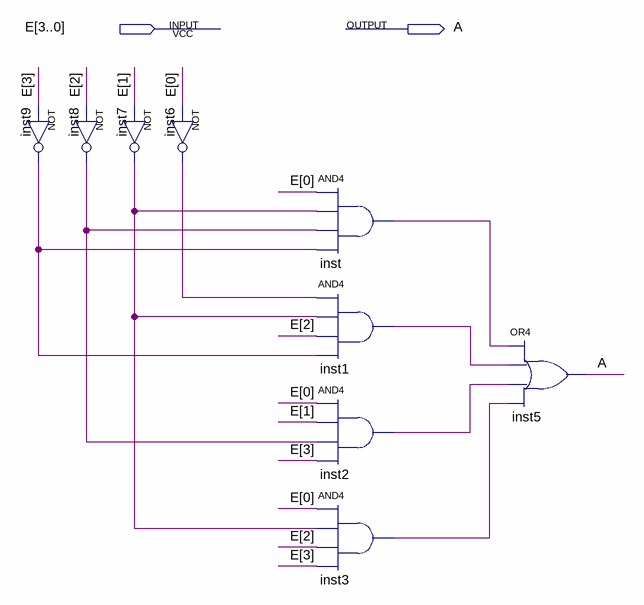
[diagram p0: schematic sheet]
// Quartus schematic ASegmentBCD.bdf as structural Verilog: 9 symbols, 2 pins
module ASegmentBCD (
  input  [3:0] E,
  output A
);

  wire inst1_out, inst2_out, inst3_out, inst6_out, inst7_out, inst8_out, inst9_out, inst_out;

  not inst9 (inst9_out, E[3]);
  not inst8 (inst8_out, E[2]);
  not inst6 (inst6_out, E[0]);
  not inst7 (inst7_out, E[1]);
  and inst (inst_out, E[0], inst7_out, inst8_out, inst9_out);
  and inst1 (inst1_out, inst6_out, inst7_out, E[2], inst9_out);
  and inst2 (inst2_out, E[0], E[1], inst8_out, E[3]);
  and inst3 (inst3_out, E[0], inst7_out, E[2], E[3]);
  or inst5 (A, inst_out, inst1_out, inst2_out, inst3_out);
endmodule
